# EAGLE schematic Headset Module (EAGLE 7.2.0)

## Sheet 1 of 3: Mixer
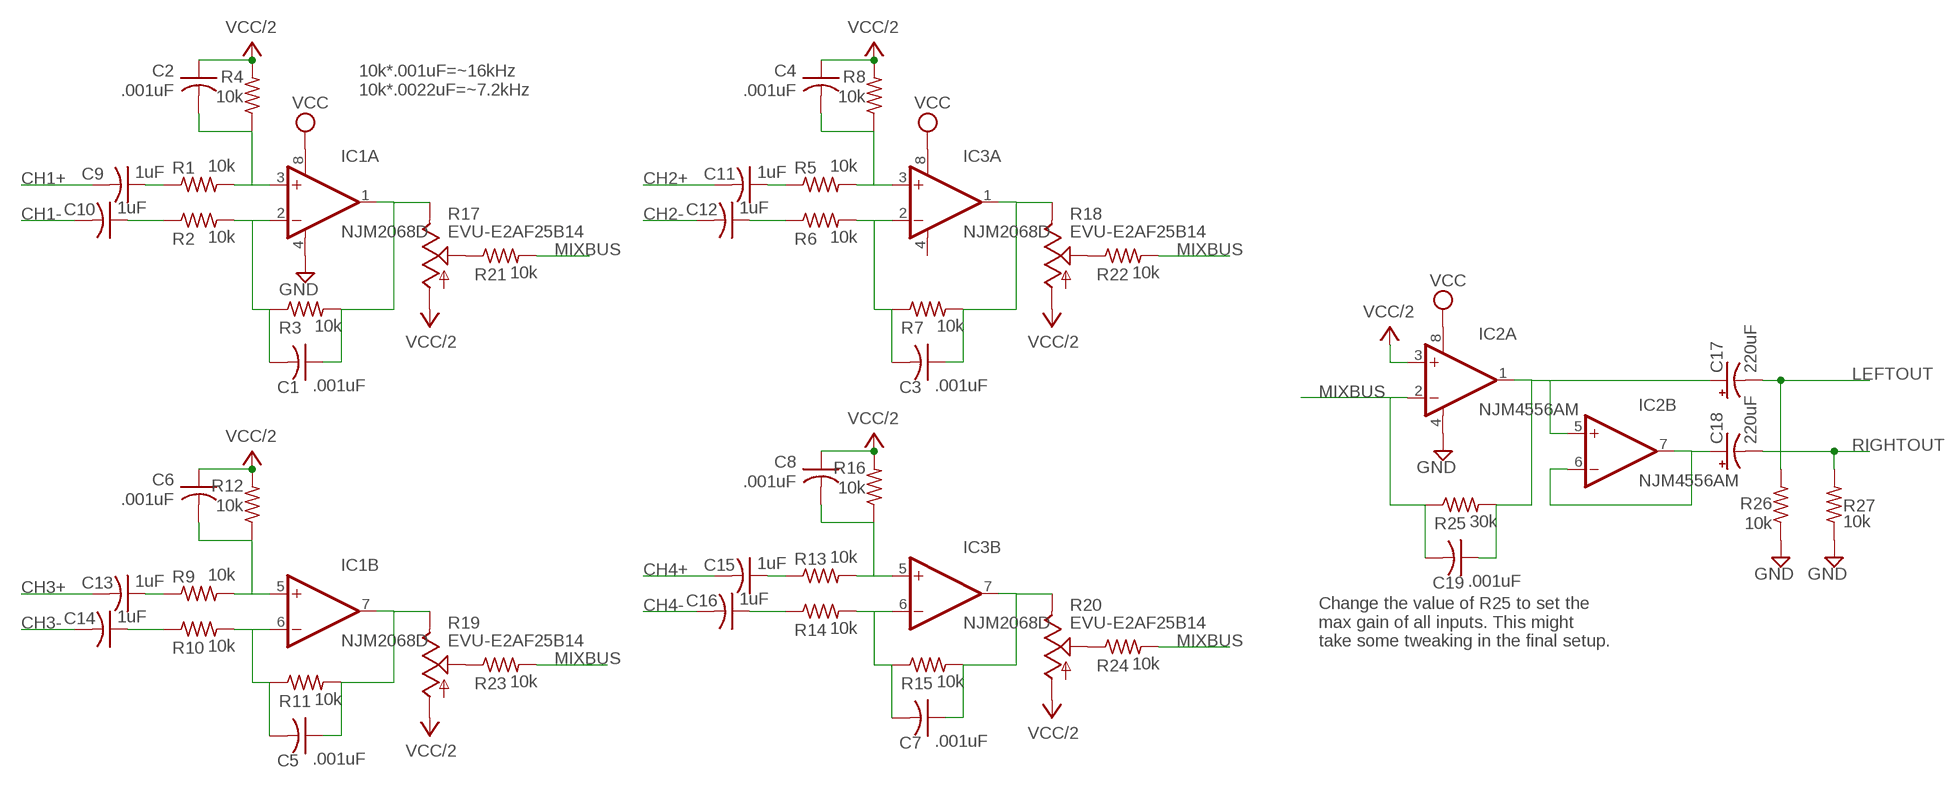
[diagram p0: schematic, sheet 1]

### Parts
C1  .001uF  C-USC1206  [C1206]
C2  .001uF  C-USC1206  [C1206]
C3  .001uF  C-USC1206  [C1206]
C4  .001uF  C-USC1206  [C1206]
C5  .001uF  C-USC1206  [C1206]
C6  .001uF  C-USC1206  [C1206]
C7  .001uF  C-USC1206  [C1206]
C8  .001uF  C-USC1206  [C1206]
C9  1uF  C-USC1206  [C1206]
C10  1uF  C-USC1206  [C1206]
C11  1uF  C-USC1206  [C1206]
C12  1uF  C-USC1206  [C1206]
C13  1uF  C-USC1206  [C1206]
C14  1uF  C-USC1206  [C1206]
C15  1uF  C-USC1206  [C1206]
C16  1uF  C-USC1206  [C1206]
C17  220uF  CPOL-USE5-10.5  [E5-10,5]
C18  220uF  CPOL-USE5-10.5  [E5-10,5]
C19  .001uF  C-USC1206  [C1206]
IC1  NJM2068D  OPA2131U  [SO08]
IC2  NJM4556AM  OPA2131U  [SO08]
IC3  NJM2068D  OPA2131U  [SO08]
R1  10k  R-US_R1206  [R1206]
R2  10k  R-US_R1206  [R1206]
R3  10k  R-US_R1206  [R1206]
R4  10k  R-US_R1206  [R1206]
R5  10k  R-US_R1206  [R1206]
R6  10k  R-US_R1206  [R1206]
R7  10k  R-US_R1206  [R1206]
R8  10k  R-US_R1206  [R1206]
R9  10k  R-US_R1206  [R1206]
R10  10k  R-US_R1206  [R1206]
R11  10k  R-US_R1206  [R1206]
R12  10k  R-US_R1206  [R1206]
R13  10k  R-US_R1206  [R1206]
R14  10k  R-US_R1206  [R1206]
R15  10k  R-US_R1206  [R1206]
R16  10k  R-US_R1206  [R1206]
R17  EVU-E2AF25B14  US-EVUE2A  [EVUE]
R18  EVU-E2AF25B14  US-EVUE2A  [EVUE]
R19  EVU-E2AF25B14  US-EVUE2A  [EVUE]
R20  EVU-E2AF25B14  US-EVUE2A  [EVUE]
R21  10k  R-US_R1206  [R1206]
R22  10k  R-US_R1206  [R1206]
R23  10k  R-US_R1206  [R1206]
R24  10k  R-US_R1206  [R1206]
R25  30k  R-US_R1206  [R1206]
R26  10k  R-US_R1206  [R1206]
R27  10k  R-US_R1206  [R1206]

### Nets
CH1+: C9.2 ; also sheet 2
CH1-: C10.2 ; also sheet 2
CH2+: C11.2 ; also sheet 2
CH2-: C12.2 ; also sheet 2
CH3+: C13.2 ; also sheet 2
CH3-: C14.2 ; also sheet 2
CH4+: C15.2 ; also sheet 2
CH4-: C16.2 ; also sheet 2
GND: IC1.4(A:V-) IC2.4(A:V-) R26.1 R27.1 ; also sheet 2
LEFTOUT: C17.- R26.2 ; also sheet 2
MIXBUS: C19.2 IC2.2(A:-IN) R21.2 R22.2 R23.2 R24.2 R25.1
N$1: C2.2 IC1.3(A:+IN) R1.2 R4.1
N$2: C1.2 IC1.2(A:-IN) R2.2 R3.1
N$3: C1.1 IC1.1(A:OUT) R3.2 R17.3(E)
N$4: C4.2 IC3.3(A:+IN) R5.2 R8.1
N$5: C3.2 IC3.2(A:-IN) R6.2 R7.1
N$6: C3.1 IC3.1(A:OUT) R7.2 R18.3(E)
N$7: C6.2 IC1.5(B:+IN) R9.2 R12.1
N$8: C5.2 IC1.6(B:-IN) R10.2 R11.1
N$9: C5.1 IC1.7(B:OUT) R11.2 R19.3(E)
N$10: C8.2 IC3.5(B:+IN) R13.2 R16.1
N$11: C7.2 IC3.6(B:-IN) R14.2 R15.1
N$12: C7.1 IC3.7(B:OUT) R15.2 R20.3(E)
N$13: R17.2(S) R21.1
N$14: R18.2(S) R22.1
N$15: R19.2(S) R23.1
N$16: R20.2(S) R24.1
N$18: C9.1 R1.1
N$19: C10.1 R2.1
N$20: C11.1 R5.1
N$21: C12.1 R6.1
N$22: C13.1 R9.1
N$23: C14.1 R10.1
N$24: C15.1 R13.1
N$25: C16.1 R14.1
N$26: C17.+ C19.1 IC2.1(A:OUT) IC2.5(B:+IN) R25.2
N$27: C18.+ IC2.6(B:-IN) IC2.7(B:OUT)
RIGHTOUT: C18.- R27.2 ; also sheet 2
V+: C2.1 C4.1 C6.1 C8.1 IC2.3(A:+IN) R4.2 R8.2 R12.2 R16.2 R17.1(A) R18.1(A) R19.1(A) R20.1(A) ; supply symbol labelled VCC/2 ; also sheet 3
VCC: IC1.8(A:V+) IC2.8(A:V+) IC3.8(A:V+) ; also sheet 2,3

### Notes on the sheet
- 10k*.001uF=~16kHz
  10k*.0022uF=~7.2kHz
- Change the value of R25 to set the
  max gain of all inputs. This might 
  take some tweaking in the final setup.

## Sheet 2 of 3: Connectors
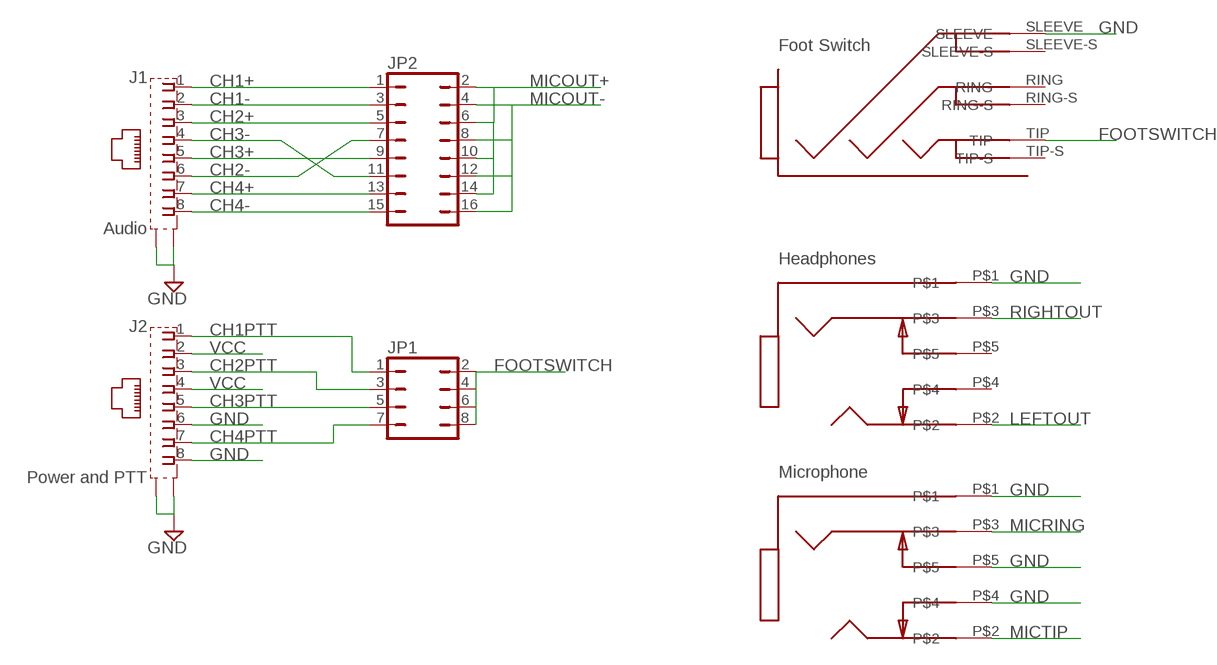
[diagram p1: schematic, sheet 2]

### Parts
J1  Audio  GLX-S-88M  [GLX-S-88M]
J2  Power and PTT  GLX-S-88M  [GLX-S-88M]
J3  NRJ6HF  [NRJ6HF]
J4  SJ1-353  [SJ1-353]
J5  SJ1-353  [SJ1-353]
JP1  JP4Q  [JP4Q]
JP2  JP8Q  [JP8Q]

### Nets
CH1+: J1.1 JP2.1 ; also sheet 1
CH1-: J1.2 JP2.3 ; also sheet 1
CH1PTT: J2.1 JP1.1
CH2+: J1.3 JP2.5 ; also sheet 1
CH2-: J1.6 JP2.7 ; also sheet 1
CH2PTT: J2.3 JP1.3
CH3+: J1.5 JP2.9 ; also sheet 1
CH3-: J1.4 JP2.11 ; also sheet 1
CH3PTT: J2.5 JP1.5
CH4+: J1.7 JP2.13 ; also sheet 1
CH4-: J1.8 JP2.15 ; also sheet 1
CH4PTT: J2.7 JP1.7
FOOTSWITCH: J3.TIP JP1.2 JP1.4 JP1.6 JP1.8
GND: J1.S1 J1.S2 J2.6 J2.8 J2.S1 J2.S2 J3.SLEEVE J4.P$1 J5.P$1 J5.P$4 J5.P$5 ; also sheet 1
LEFTOUT: J4.P$2 ; also sheet 1
MICOUT+: JP2.2 JP2.6 JP2.10 JP2.14 ; also sheet 3
MICOUT-: JP2.4 JP2.8 JP2.12 JP2.16 ; also sheet 3
MICRING: J5.P$3 ; also sheet 3
MICTIP: J5.P$2 ; also sheet 3
RIGHTOUT: J4.P$3 ; also sheet 1
VCC: J2.2 J2.4 ; also sheet 1,3
Unconnected: J3.RING J3.RING-S J3.SLEEVE-S J3.TIP-S J4.P$4 J4.P$5

### Notes on the sheet
- Foot Switch
- Headphones
- Microphone

## Sheet 3 of 3: Mic Amp
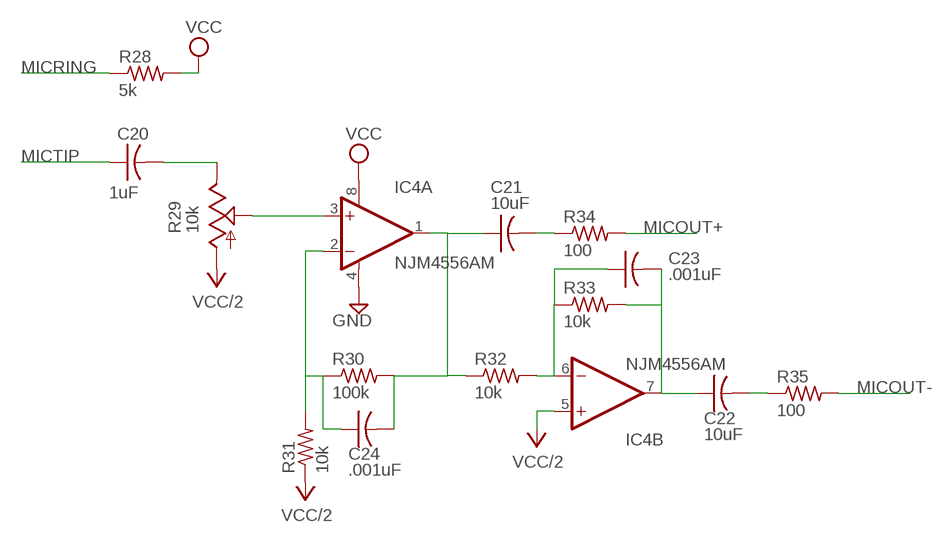
[diagram p2: schematic, sheet 3]

### Parts
C20  1uF  C-USC1206  [C1206]
C21  10uF  C-USC1206  [C1206]
C22  10uF  C-USC1206  [C1206]
C23  .001uF  C-USC1206  [C1206]
C24  .001uF  C-USC1206  [C1206]
IC4  NJM4556AM  OPA2131U  [SO08]
R28  5k  R-US_R1206  [R1206]
R29  10k  TRIM_US-S64W  [S64W]
R30  100k  R-US_R1206  [R1206]
R31  10k  R-US_R1206  [R1206]
R32  10k  R-US_R1206  [R1206]
R33  10k  R-US_R1206  [R1206]
R34  100  R-US_R1206  [R1206]
R35  100  R-US_R1206  [R1206]

### Nets
MICOUT+: R34.2 ; also sheet 2
MICOUT-: R35.2 ; also sheet 2
MICRING: R28.1 ; also sheet 2
MICTIP: C20.1 ; also sheet 2
N$17: C20.2 R29.E
N$28: IC4.3(A:+IN) R29.S
N$29: C24.1 IC4.2(A:-IN) R30.1 R31.2
N$30: C21.1 C24.2 IC4.1(A:OUT) R30.2 R32.1
N$31: C23.1 IC4.6(B:-IN) R32.2 R33.1
N$32: C22.1 C23.2 IC4.7(B:OUT) R33.2
N$33: C21.2 R34.1
N$34: C22.2 R35.1
V+: IC4.5(B:+IN) R31.1 ; supply symbol labelled VCC/2 ; also sheet 1
VCC: R28.2 ; also sheet 1,2
Unconnected: R29.A

## Power pins joined to a net without a drawn wire
V+: IC4.8(A:V+)
V-: IC3.4(A:V-) IC4.4(A:V-)

## Library data of the parts
C1-C16 C19-C24 = resistor:C-US: CAPACITOR, American symbol
C17 C18 = resistor:CPOL-US: POLARIZED CAPACITOR, American symbol
IC1-IC4 = burr-brown:OPA2131: General Purpose FET-Input Operational Amplifiers Product Folder:OPA2131; MF: TEXAS INSTRUMENT CONNECTORS; MPN: OPA2131UJ/2K5; OC_FARNELL: 1575488; OC_NEWARK: 75C4620
J1 J2 = con-kycon:GLX-S-88M: Mod. Jack, Right Angle, 8 posiotion, 8 contatcs RJ45 Source: GLX-S-88M.pdf; OC_FARNELL: unknown; OC_NEWARK: unknown
J3 = con-neutrik_ag:NRJ6HF
J4 J5 = con-cui:SJ1-353
JP1 = jumper:JP4Q: JUMPER
JP2 = jumper:JP8Q: JUMPER
R1-R16 R21-R28 R30-R35 = resistor:R-US_: RESISTOR, American symbol
R17-R20 = pot:US-EVU: 9 mm Square Rotary Potentiometers Source: Panasonic
R29 = pot:TRIM_US-: POTENTIOMETER